# Altium schematic sheet 2_Connectors.schdoc
size 309 x 223 mm; Symbol: Sheet-Symbol_A4; Device: Sheet-Symbol_A4; Company: EasyEDA.com; Drawed: EasyEDA Pro; Reviewed: EasyEDA Pro; Version: V0.1; Page Size: A4; @Project Name: Scanning Tunneling Microscope; @Page Count: 3; @Update Date: 2023-05-22; @Create Date: 2023-05-01; @Schematic Name: Controller; Part Number: JLCPCB-002; @Page No: 3; @Page Name: Connectors
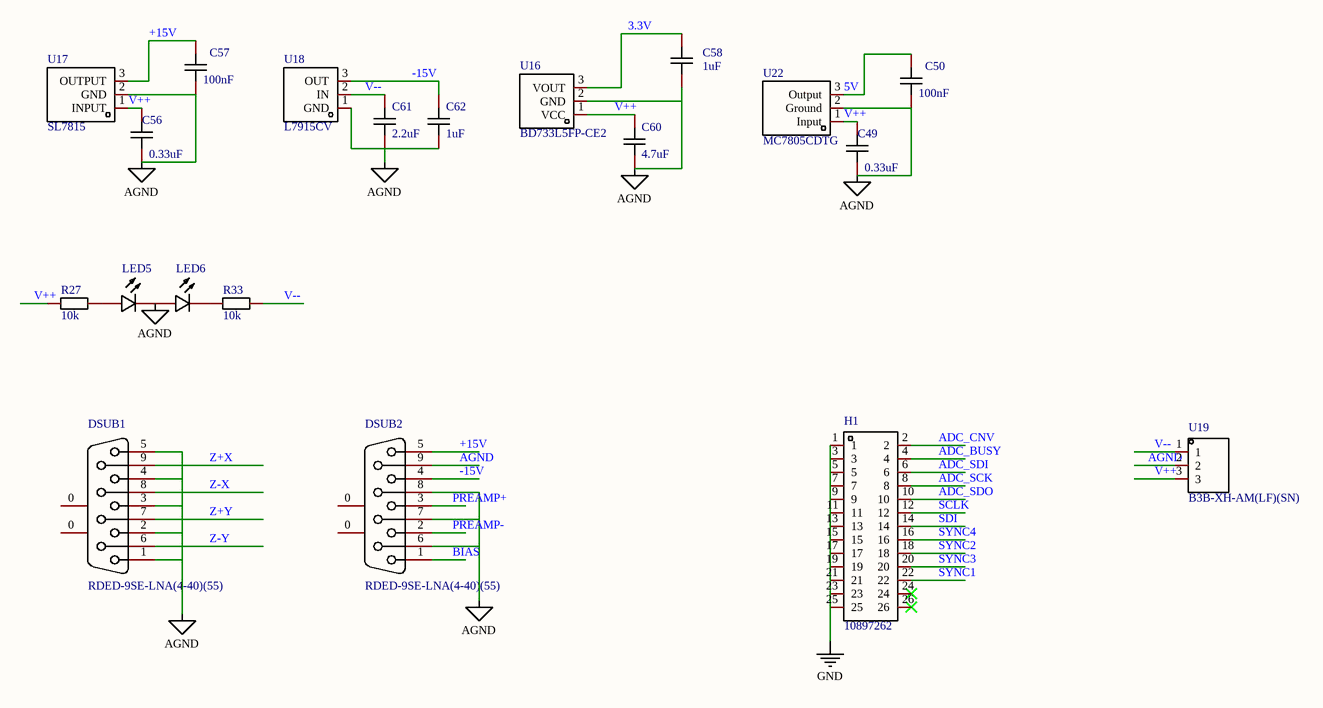
[diagram p0: 2_Connectors.schdoc]

## Parts
C49  0.33uF  [C0603]
C50  100nF  [C0603]
C56  0.33uF  [C0603]
C57  100nF  [C0603]
C58  1uF  [C0603]
C60  4.7uF  [C0603]
C61  2.2uF  [C0603]
C62  1uF  [C0603]
DSUB1  RDED-9SE-LNA(4-40)(55)  [DSUB-TH_9P-P2.74-S2.84_L18.5-W30.8-M]
DSUB2  RDED-9SE-LNA(4-40)(55)  [DSUB-TH_9P-P2.74-S2.84_L18.5-W30.8-M]
H1  10897262  [HDR-TH_26P-P2.54-V-M-R2-C13-S2.54]
LED5  19-217/R6C-AL1M2VY/3T  [LED0603-R-RD]  (value not drawn)
LED6  19-217/R6C-AL1M2VY/3T  [LED0603-R-RD]  (value not drawn)
R27  value 10k  [R0603]  (hidden comment: 0603WAF1002T5E)
R33  value 10k  [R0603]  (hidden comment: 0603WAF1002T5E)
U16  BD733L5FP-CE2  [TO-252-3L_L6.6-W6.1-P4.60-LS9.5-BR-CW]
U17  SL7815  [TO-220-3_L10.0-W4.5-P2.54-L]
U18  L7915CV  [TO-220-3_L10.0-W4.5-P2.54-L]
U19  B3B-XH-AM(LF)(SN)  [CONN-TH_3P-P2.50_B3B-XH-AM-LF-SN]
U22  MC7805CDTG  [DPAK_L6.6-W6.2-P2.29-LS9.7-BR]

## Nets
AGND: C49.2 C50.1 C56.2 C57.1 C58.1 C60.2 C61.2 C62.1 DSUB1.1 DSUB1.2 DSUB1.3 DSUB1.4 DSUB1.5 DSUB2.6 DSUB2.7 DSUB2.8 DSUB2.9 LED5.2(C) LED6.1(A) U16.2(GND) U17.2(GND) U18.1(GND) U19.2 U22.2(Ground)
GND: H1.1 H1.3 H1.5 H1.7 H1.9 H1.11 H1.13 H1.15 H1.17 H1.19 H1.21 H1.23 H1.25
3.3V: C58.2 U16.3(VOUT)
5V: C50.2 U22.3(Output)
+15V: C57.2 DSUB2.5 U17.3(OUTPUT)
-15V: C62.2 DSUB2.4 U18.3(OUT)
ADC_BUSY: H1.4
ADC_CNV: H1.2
ADC_SCK: H1.8
ADC_SDI: H1.6
ADC_SDO: H1.10
BIAS: DSUB2.1
PREAMP+: DSUB2.3
PREAMP-: DSUB2.2
SCLK: H1.12
SDI: H1.14
SYNC1: H1.22
SYNC2: H1.18
SYNC3: H1.20
SYNC4: H1.16
V++: C49.1 C56.1 C60.1 R27.1 U16.1(VCC) U17.1(INPUT) U19.3 U22.1(Input)
V--: C61.1 R33.2 U18.2(IN) U19.1
Z+X: DSUB1.9
Z+Y: DSUB1.7
Z-X: DSUB1.8
Z-Y: DSUB1.6
NetLED5_1: LED5.1(A) R27.2
NetLED6_2: LED6.2(C) R33.1

Not connected (* = marked no-connect by the designer): DSUB1 0; DSUB2 0; H1 24* 26*

## Notes on the sheet
- 1
- 2
- 3
- 4
- 5
- 6
- A
- B
- C
- Schematic
- Controller
- Create Date
- Update Date
- 2023-05-22
- 2023-05-01
- Reviewed
- Drawed
- Page
- EasyEDA Pro
- Connectors
- Part Number
- Scanning Tunneling Microscope
- JLCPCB-002
- D
- VER
- SIZE
- PAGE
- OF
- V0.1
- A4
- EasyEDA.com

## Library data of the parts
C49 C50 C56-C58 C60-C62 = CAP_0603: Symbol: CAP; Convert to PCB: yes; Device: CAP_0603; Add into BOM: yes; Supplier Footprint: 0603
  C49 C56: Name: 0.33uF; Value: 0.33uF
  C50 C57: Name: 100nF; Value: 100nF
  C58 C62: Name: 1uF; Value: 1uF
  C60: Name: 4.7uF; Value: 4.7uF
  C61: Name: 2.2uF; Value: 2.2uF
DSUB1 DSUB2 = RDED-9SE-LNA(4-40)(55): Manufacturer: HRS(广濑); Add into BOM: yes; Name: RDED-9SE-LNA(4-40)(55); Symbol: RDED-9SE-LNA(4-40)(55); Device: RDED-9SE-LNA(4-40)(55); LCSC Part Name: RDED-9SE-LNA(4-40)(55); Supplier Part: C324990; Manufacturer Part: RDED-9SE-LNA(4-40)(55); Supplier Footprint: -; JLCPCB Part Class: Extended Part; Datasheet: https://atta.szlcsc.com/upload/public/pdf/source/20181031/C324990_1C30430775BD778D10633A35FD38E859.pdf; Supplier: LCSC; Convert to PCB: yes
H1 = 10897262: Pitch:2.54mm Number of Pins:26 Number of Rows: Pin Structure:2x13P Row Spacing:2.54mm Mounting Type:Straight Circluar Pins/Square Pins:Square Pins Current Rating (Max):- Voltage Rating (Max):- Length of Mating Pin:6.1mm Insulation Height:2.29mm Length of; Manufacturer: MOLEX; Add into BOM: yes; Pitch: 2.54mm; Pin Structure: 2x13P; Name: 10897262; Symbol: 10897262; Device: 10897262; LCSC Part Name: 2.54mm 2x13P 直插 方针; Supplier Part: C586270; Manufacturer Part: 10897262; Supplier Footprint: 直插,P=2.54mm; JLCPCB Part Class: Extended Part; Datasheet: https://atta.szlcsc.com/upload/public/pdf/source/20200716/C585622_346B36A4E49C3AB4BB06E0932C7001B0.pdf; Supplier: LCSC; Convert to PCB: yes; Number of Pins: 26; Row Spacing: 2.54mm; Mounting Type: Straight; Circluar Pins/Square Pins: Square Pins; Current Rating (Max): -; Voltage Rating (Max): -; Length of Mating Pin: 6.1mm; Insulation Height: 2.29mm; Length of End Connection Pin: -; Contact Plating: -; Operating Temperature Range: -; Welding Temperature (Max): -; Color: -
LED5 LED6 = 19-217/R6C-AL1M2VY/3T: 发光颜色:红灯;二极管配置:-;透镜颜色:无色透明;主波长:617.5nm;峰值波长:632nm;色温:-;光通量(25时):-;测试电流:5mA;正向电压(VF):2.2V;发光强度:28.5mcd;功率:60mW;发光角度:120°;安装方式:-;工作温度:-40~+85;; Manufacturer: EVERLIGHT(台湾亿光); Add into BOM: yes; Emitted Color: 红灯; Lens Color: 无色透明; Peak Wavelength: 632nm; Forward Current: 5mA; Forward Voltage (VF): 2.2V; Power Dissipation: 60mW; Viewing Angle: 120°; Symbol: 19-217/R6C-AL1M2VY/3T; Device: 19-217/R6C-AL1M2VY/3T; LCSC Part Name: 0603 红灯; Supplier Part: C72044; Manufacturer Part: 19-217/R6C-AL1M2VY/3T; Supplier Footprint: 0603; JLCPCB Part Class: Extended Part; Datasheet: https://atta.szlcsc.com/upload/public/pdf/source/20160507/1462613613821.pdf; Supplier: LCSC; Convert to PCB: yes; Diode Configuration: -; Dominant Wavelength: 617.5nm; Color Temperature: -; Luminous Flux (@25℃): -; Luminous Intensity: 28.5mcd; Mounting Sytle: -; Operating Temperature: -40~+85
R27 R33 = 0603WAF1002T5E: 电阻类型:厚膜电阻;阻值:10k;精度:±1%;功率:1/10W;温度系数:±100ppm/;最大工作电压:75V;工作温度范围:-55~+155;; Manufacturer: UNI-ROYAL(厚声); Add into BOM: yes; Tolerance: ±1%; Power(Watts): 1/10W; Overload Voltage (Max): 75V; Symbol: 0603WAF1002T5E; Device: 0603WAF1002T5E; LCSC Part Name: 10k ±1%; Supplier Part: C25804; Manufacturer Part: 0603WAF1002T5E; Supplier Footprint: 0603; JLCPCB Part Class: Basic Part; Datasheet: https://atta.szlcsc.com/upload/public/pdf/source/20200306/C422600_1E6D84923E4A46A82E41ADD87F860B5C.pdf; Supplier: LCSC; Convert to PCB: yes; Type: 厚膜电阻; Temperature Coefficient: ±100ppm/; Operating Temperature Range: -55~+155
U16 = BD733L5FP-CE2: Manufacturer: ROHM(罗姆); Add into BOM: yes; Name: BD733L5FP-CE2; Symbol: BD733L5FP-CE2; Device: BD733L5FP-CE2; LCSC Part Name: BD733L5FP-CE2; Supplier Part: C509724; Manufacturer Part: BD733L5FP-CE2; Supplier Footprint: TO-252-3; JLCPCB Part Class: Extended Part; Datasheet: https://atta.szlcsc.com/upload/public/pdf/source/20230201/396DA52F76B265AFAA10405709CD3C0A.pdf; Supplier: LCSC; Convert to PCB: yes
U17 = SL7815: Output Type: Output Polarity:Positive Number of Outputs:1 Maximum Input Voltage:30V Output Voltage:15V~15V Output Voltage:15V~15V Dropout Voltage:2V@(500mA) Output Current:1A Power Supply Rejection Ratio (PSRR):70dB@(120Hz); Manufacturer: Slkor(萨科微); Add into BOM: yes; Number of Outputs: 1; Maximum Input Voltage: 30V; Output Current: 1A; Name: SL7815; Symbol: SL7815; Device: SL7815; LCSC Part Name: 正 Vin=30V Vout=15V 1A 70dB@(120Hz); Supplier Part: C458979; Manufacturer Part: SL7815; Supplier Footprint: TO-220; JLCPCB Part Class: Extended Part; Datasheet: https://atta.szlcsc.com/upload/public/pdf/source/20191121/C458979_7C045E8EA06C0BC569B49C0292DDB5EB.pdf; Supplier: LCSC; Convert to PCB: yes; Output Polarity: Positive; Output Voltage: 15V~15V; Dropout Voltage: 2V@(500mA); Power Supply Rejection Ratio (PSRR): 70dB@(120Hz)
U18 = L7915CV: Output Type: Output Polarity:Negative Number of Outputs:1 Maximum Input Voltage:35V Output Voltage:15V~15V Output Voltage:15V~15V Dropout Voltage:1.1V@(1A) Output Current:1.5A Power Supply Rejection Ratio (PSRR):60dB@(120Hz); Manufacturer: ST(意法半导体); Add into BOM: yes; Number of Outputs: 1; Maximum Input Voltage: 35V; Output Current: 1.5A; Name: L7915CV; Symbol: L7915CV; Device: L7915CV; LCSC Part Name: L7915CV; Supplier Part: C154950; Manufacturer Part: L7915CV; Supplier Footprint: TO-220; JLCPCB Part Class: Extended Part; Datasheet: https://atta.szlcsc.com/upload/public/pdf/source/20180301/C154950_15198941423711383385.pdf; Supplier: LCSC; Convert to PCB: yes; Output Polarity: Negative; Output Voltage: 15V~15V; Dropout Voltage: 1.1V@(1A); Power Supply Rejection Ratio (PSRR): 60dB@(120Hz)
U19 = B3B-XH-AM(LF)(SN): Reference Series:XH Pitch:2.5mm Pins Structure:1x3P Number of Rows:1 Number of PINs Per Row:3 Row Spacing:- Mounting Style:- Contact Material:Brass; Manufacturer: JST; Symbol: B3B-XH-AM-(LF)(SN); Add into BOM: yes; Reference Series: XH; Pitch: 2.5mm; Pins Structure: 1x3P; Number of PINs Per Row: 3; Name: B3B-XH-AM(LF)(SN); Device: B3B-XH-AM(LF)(SN); LCSC Part Name: XH 2.5mm 1x3P; Supplier Part: C161870; Manufacturer Part: B3B-XH-AM(LF)(SN); Supplier Footprint: 插件,P=2.5mm; JLCPCB Part Class: Extended Part; Datasheet: https://atta.szlcsc.com/upload/public/pdf/source/20180531/C161870_3E9DCF0B047693C204E35D1E5FF841C1.pdf; Supplier: LCSC; Convert to PCB: yes; Number of Rows: 1; Row Spacing: -; Mounting Style: -; Contact Material: Brass
U22 = MC7805CDTG: Manufacturer: onsemi(安森美); Add into BOM: yes; Name: MC7805CDTG; Symbol: MC7805CDTG; Device: MC7805CDTG; LCSC Part Name: 线性电压稳压器，1 A，5 至 24 V，正向; Supplier Part: C897464; Manufacturer Part: MC7805CDTG; Supplier Footprint: DPAK; JLCPCB Part Class: Extended Part; Datasheet: https://atta.szlcsc.com/upload/public/pdf/source/20221020/B822C9350C81A84B74CC7C0C15A8E182.pdf; Supplier: LCSC; Convert to PCB: yes